# EAGLE design Pollin_NetIO_Clone (EAGLE 9.6.2)
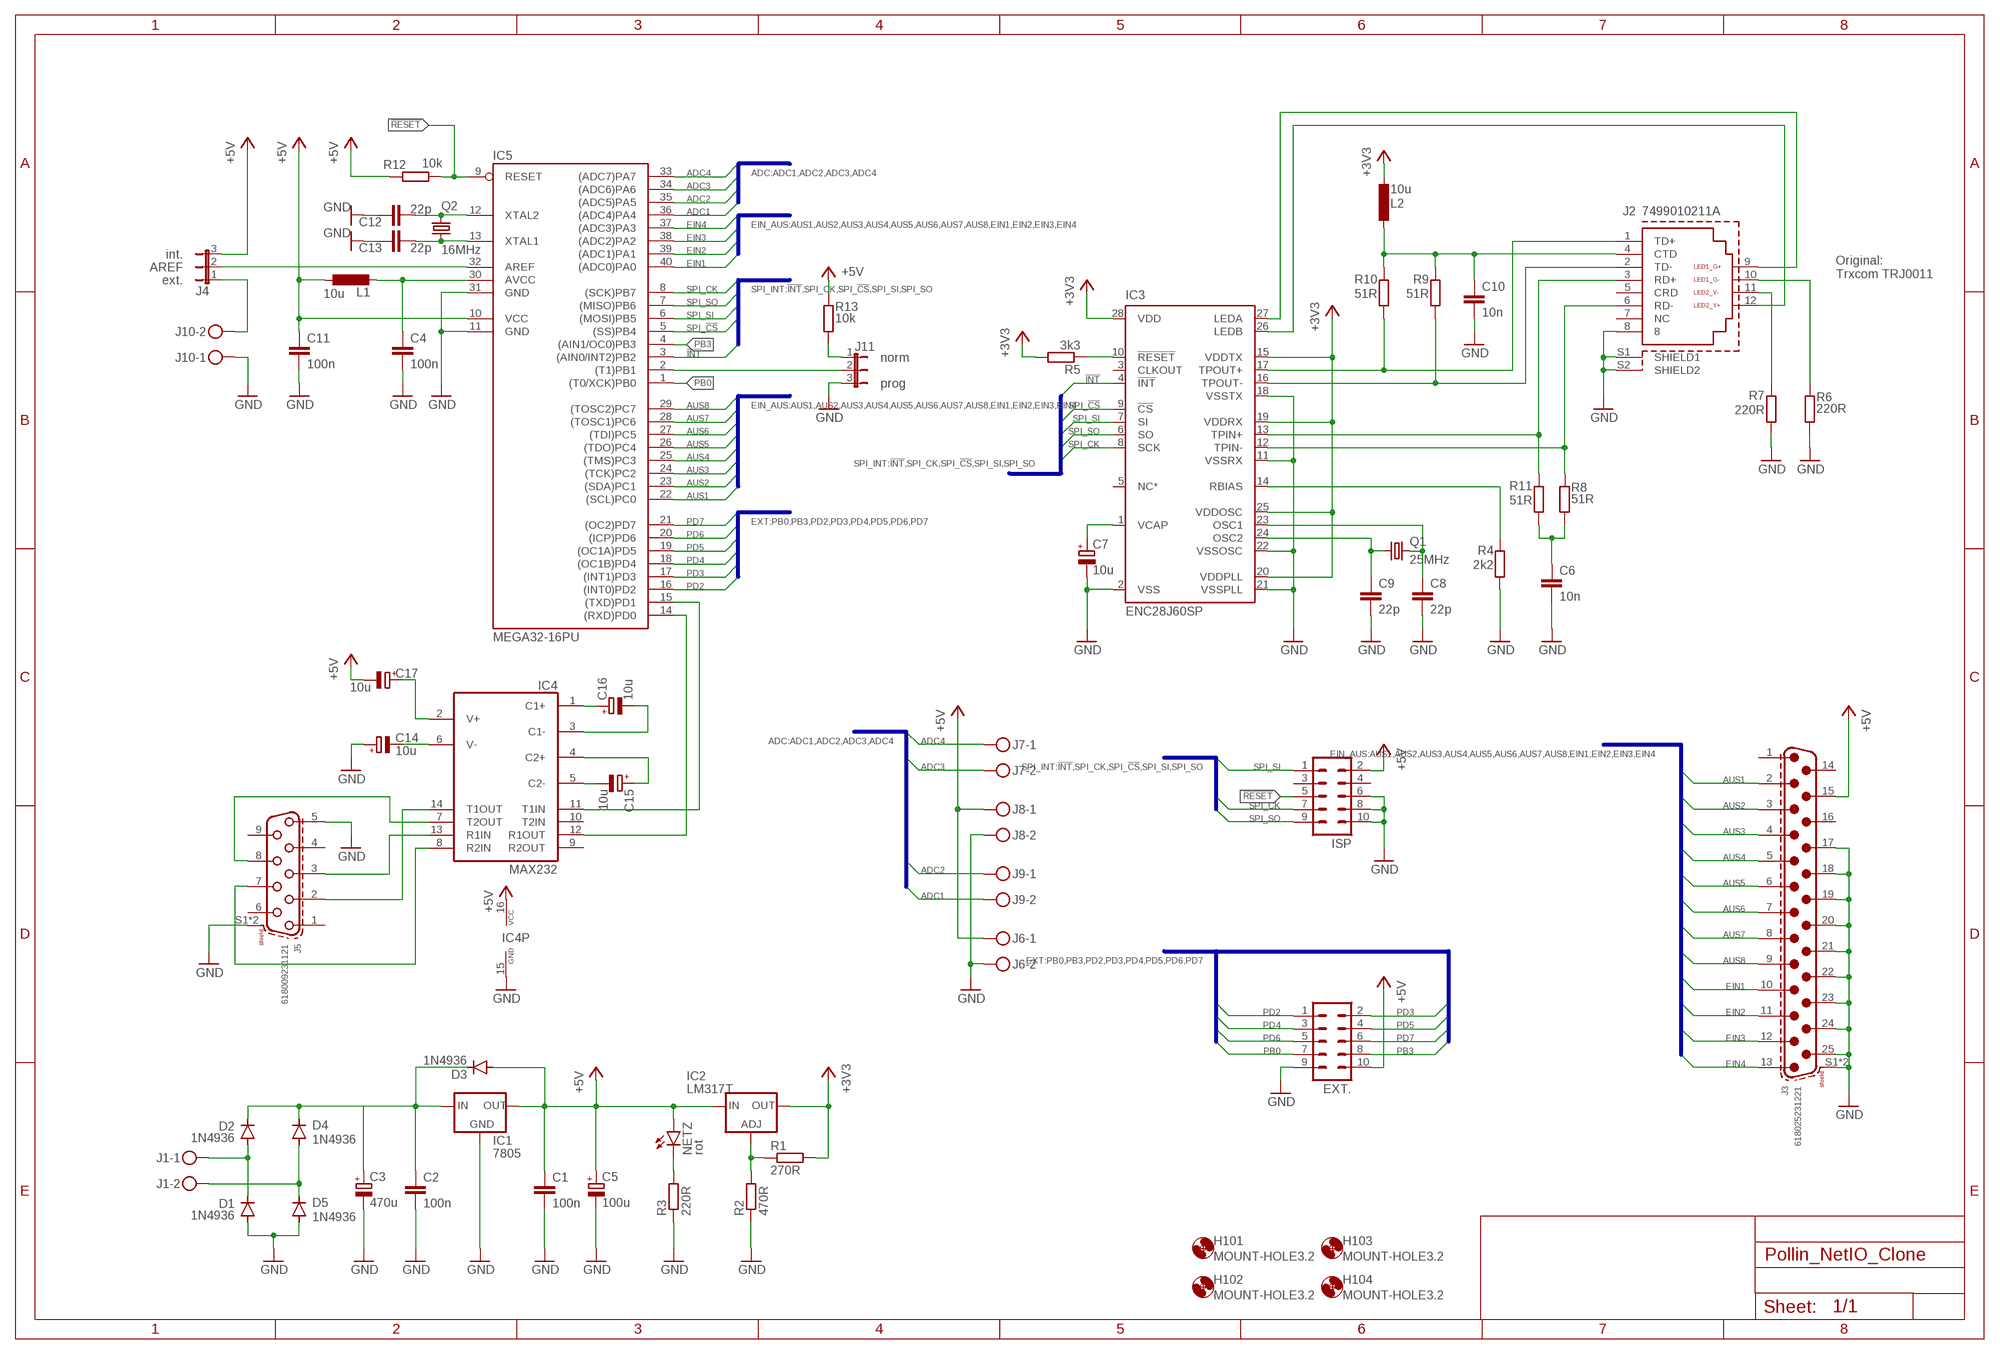
[diagram p0: schematic, sheet 1]

## Parts
C1  100n  C-EU050-025X075  [C050-025X075]
C2  100n  C-EU050-025X075  [C050-025X075]
C3  470u  CPOL-EUE5-10.5  [E5-10,5]
C4  100n  C-EU050-025X075  [C050-025X075]
C5  100u  CPOL-EUE5-5  [E5-5]
C6  10n  C-EU050-025X075  [C050-025X075]
C7  10u  CPOL-EUE5-5  [E5-5]
C8  22p  C-EU050-024X044  [C050-024X044]
C9  22p  C-EU050-024X044  [C050-024X044]
C10  10n  C-EU050-025X075  [C050-025X075]
C11  100n  C-EU050-025X075  [C050-025X075]
C12  22p  C-EU050-024X044  [C050-024X044]
C13  22p  C-EU050-024X044  [C050-024X044]
C14  10u  CPOL-EUE5-5  [E5-5]
C15  10u  CPOL-EUE5-5  [E5-5]
C16  10u  CPOL-EUE5-5  [E5-5]
C17  10u  CPOL-EUE5-5  [E5-5]
D1  1N4936  1N4933  [DO41-10]
D2  1N4936  1N4933  [DO41-10]
D3  1N4936  1N4933  [DO41-10]
D4  1N4936  1N4933  [DO41-10]
D5  1N4936  1N4933  [DO41-10]
EXT.  ML10  [ML10]
H101  MOUNT-HOLE3.2  [3,2]
H102  MOUNT-HOLE3.2  [3,2]
H103  MOUNT-HOLE3.2  [3,2]
H104  MOUNT-HOLE3.2  [3,2]
IC1  7805  78XXS  [78XXS]
IC2  LM317T  LM317TS  [317TS]
IC3  ENC28J60SP  [DIL28-3]
IC4  MAX232  [DIL16]
IC5  MEGA32-16PU  MEGA32-P  [DIL40]
ISP  ML10  [ML10]
J1  MKDSN1,5/2-5,08  [MKDSN1,5/2-5,08]
J2  7499010211A  WE-RJ45_7499010211A  [7499010211A]
J3  618025231221  6180XX231221_618025231221  [618025231221]
J4  JP2E  [JP2]
J5  618009231121  6180XX231121_618009231121  [618009231121]
J6  MKDSN1,5/2-5,08  [MKDSN1,5/2-5,08]
J7  MKDSN1,5/2-5,08  [MKDSN1,5/2-5,08]
J8  MKDSN1,5/2-5,08  [MKDSN1,5/2-5,08]
J9  MKDSN1,5/2-5,08  [MKDSN1,5/2-5,08]
J10  MKDSN1,5/2-5,08  [MKDSN1,5/2-5,08]
J11  JP2E  [JP2]
L1  10u  L-EU0207/15  [0207/15]
L2  10u  L-EU0207/15  [0207/15]
NETZ  rot  LED5MM  [LED5MM]
Q1  25MHz  CRYSTALHC49S  [HC49/S]
Q2  16MHz  CRYSTALHC49S  [HC49/S]
R1  270R  R-EU_0207/10  [0207/10]
R2  470R  R-EU_0207/10  [0207/10]
R3  220R  R-EU_0207/10  [0207/10]
R4  2k2  R-EU_0207/10  [0207/10]
R5  3k3  R-EU_0207/10  [0207/10]
R6  220R  R-EU_0207/10  [0207/10]
R7  220R  R-EU_0207/10  [0207/10]
R8  51R  R-EU_0207/10  [0207/10]
R9  51R  R-EU_0207/10  [0207/10]
R10  51R  R-EU_0207/10  [0207/10]
R11  51R  R-EU_0207/10  [0207/10]
R12  10k  R-EU_0207/10  [0207/10]
R13  10k  R-EU_0207/10  [0207/10]

## Nets
!INT: IC3.4(!INT) IC5.3((AIN0/INT2)PB2)
!RESET: IC5.9(RESET) ISP.5 R12.2
+3V3: IC2.2(OUT) IC3.15(VDDTX) IC3.19(VDDRX) IC3.20(VDDPLL) IC3.25(VDDOSC) IC3.28(VDD) L2.2 R1.2 R5.2
+5V: C1.1 C5.+ C11.1 C17.- D3.A EXT..10 IC1.OUT IC2.3(IN) IC4.16(VCC) IC5.10(VCC) ISP.2 J3.15 J4.3 J6.1 J8.1 L1.1 NETZ.A R12.1 R13.2
ADC1: IC5.36((ADC4)PA4) J9.2
ADC2: IC5.35((ADC5)PA5) J9.1
ADC3: IC5.34((ADC6)PA6) J7.2
ADC4: IC5.33((ADC7)PA7) J7.1
AREF: IC5.32(AREF) J4.2
AREF_EXT: J4.1 J10.2
AUS1: IC5.22((SCL)PC0) J3.2
AUS2: IC5.23((SDA)PC1) J3.3
AUS3: IC5.24((TCK)PC2) J3.4
AUS4: IC5.25((TMS)PC3) J3.5
AUS5: IC5.26((TDO)PC4) J3.6
AUS6: IC5.27((TDI)PC5) J3.7
AUS7: IC5.28((TOSC1)PC6) J3.8
AUS8: IC5.29((TOSC2)PC7) J3.9
AVCC: C4.1 IC5.30(AVCC) L1.2
EIN1: IC5.40((ADC0)PA0) J3.10
EIN2: IC5.39((ADC1)PA1) J3.11
EIN3: IC5.38((ADC2)PA2) J3.12
EIN4: IC5.37((ADC3)PA3) J3.13
GND: C1.2 C2.2 C3.- C4.2 C5.- C6.2 C7.- C8.2 C9.2 C10.2 C11.2 C12.1 C13.1 C14.+ D1.A D5.A EXT..9 IC1.GND IC3.2(VSS) IC3.11(VSSRX) IC3.18(VSSTX) IC3.21(VSSPLL) IC3.22(VSSOSC) IC4.15(GND) IC5.11(GND) IC5.31(GND) ISP.6 ISP.8 ISP.10 J2.8 J2.S1(SHIELD1) J2.S2(SHIELD2) J3.17 J3.18 J3.19 J3.20 J3.21 J3.22 J3.23 J3.24 J3.25 J3.S1(SHIELD) J3.S2(SHIELD) J5.5 J5.S1(SHIELD) J5.S2(SHIELD) J6.2 J8.2 J10.1 J11.3 R2.1 R3.1 R4.1 R6.1 R7.1
LEDA: IC3.27(LEDA) J2.9(LED1_G+)
LEDB: IC3.26(LEDB) J2.12(LED2_Y+)
N$1: C12.2 IC5.12(XTAL2) Q2.2
N$2: C13.2 IC5.13(XTAL1) Q2.1
N$4: IC5.2((T1)PB1) J11.2
N$6: C8.1 IC3.23(OSC1) Q1.1
N$7: C9.1 IC3.24(OSC2) Q1.2
N$9: D1.C D2.A J1.1
N$10: D4.A D5.C J1.2
N$11: C2.1 C3.+ D2.C D3.C D4.C IC1.IN
N$12: NETZ.K(C) R3.2
N$13: IC3.14(RBIAS) R4.2
N$14: IC2.1(ADJ) R1.1 R2.2
N$15: IC3.10(!RESET) R5.1
N$16: IC3.17(TPOUT+) J2.1(TD+) R10.1
N$17: IC3.16(TPOUT-) J2.2(TD-) R9.1
N$18: IC3.13(TPIN+) J2.3(RD+) R11.2
N$19: IC3.12(TPIN-) J2.6(RD-) R8.2
N$20: C10.1 J2.4(CTD) L2.1 R9.2 R10.2
N$21: C6.1 R8.1 R11.1
N$24: J11.1 R13.1
N$26: C7.+ IC3.1(VCAP)
N$27: C16.+ IC4.1(C1+)
N$28: C16.- IC4.3(C1-)
N$29: C15.+ IC4.4(C2+)
N$30: C15.- IC4.5(C2-)
N$31: C17.+ IC4.2(V+)
N$32: C14.- IC4.6(V-)
N$33: IC4.7(T2OUT) J5.8
N$34: IC4.8(R2IN) J5.7
N$35: IC4.14(T1OUT) J5.2
N$36: IC4.13(R1IN) J5.3
N$38: J2.11(LED2_Y-) R7.2
N$39: J2.10(LED1_G-) R6.2
PB0: EXT..7 IC5.1((T0/XCK)PB0)
PB3: EXT..8 IC5.4((AIN1/OC0)PB3)
PD2: EXT..1 IC5.16((INT0)PD2)
PD3: EXT..2 IC5.17((INT1)PD3)
PD4: EXT..3 IC5.18((OC1B)PD4)
PD5: EXT..4 IC5.19((OC1A)PD5)
PD6: EXT..5 IC5.20((ICP)PD6)
PD7: EXT..6 IC5.21((OC2)PD7)
RXD: IC4.12(R1OUT) IC5.14((RXD)PD0)
SPI_!CS: IC3.9(!CS) IC5.5((SS)PB4)
SPI_CK: IC3.8(SCK) IC5.8((SCK)PB7) ISP.7
SPI_SI: IC3.7(SI) IC5.6((MOSI)PB5) ISP.1
SPI_SO: IC3.6(SO) IC5.7((MISO)PB6) ISP.9
TXD: IC4.11(T1IN) IC5.15((TXD)PD1)
Unconnected: IC3.3(CLKOUT) IC3.5(NC*) IC4.9(R2OUT) IC4.10(T2IN) ISP.3 ISP.4 J2.5(CRD) J2.7(NC) J3.1 J3.14 J3.16 J5.1 J5.4 J5.6 J5.9

## Buses
SPI_INT:!INT,SPI_CK,SPI_!CS,SPI_SI,SPI_SO
EIN_AUS:AUS1,AUS2,AUS3,AUS4,AUS5,AUS6,AUS7,AUS8,EIN1,EIN2,EIN3,EIN4
ADC:ADC1,ADC2,ADC3,ADC4
EXT:PB0,PB3,PD2,PD3,PD4,PD5,PD6,PD7

## Notes on the sheet
- int.
- AREF
- Original:
  Trxcom TRJ0011
- ext.
- norm
- prog

## Library data of the parts
C1 C2 C4 C6 C8-C13 = rcl:C-EU: CAPACITOR, European symbol; SPICEPREFIX: C
C3 C5 C7 C14-C17 = rcl:CPOL-EU: POLARIZED CAPACITOR, European symbol; SPICEPREFIX: C
D1-D5 = diode:1N4933: DIODE fast recovery rectifier, 1A
EXT. ISP = con-ml:ML10: HARTING; OC_FARNELL: unknown; OC_NEWARK: unknown
H101-H104 = holes:MOUNT-HOLE: MOUNTING HOLE with drill center marker
IC1 = v-reg:78XXS: VOLTAGE REGULATOR
IC2 = v-reg:LM317TS: VOLTAGE REGULATOR
IC3 = microchip:ENC28J60: Stand-Alone Ethernet Controller with SPI Interface Source: http://ww1.microchip.com/downloads/en/DeviceDoc/39662c.pdf; MF: MICROCHIP; MPN: ENC28J60/SP; OC_FARNELL: 1084619; OC_NEWARK: 96K3661
IC4 = maxim:MAX232: RS232 TRANSCEIVER; MF: MAXIM; MPN: MAX232ACPE+; OC_FARNELL: 9723773; OC_NEWARK: 68K4544
IC5 = atmel:MEGA32-P: MICROCONTROLLER 32 Kbytes FLASH 2 Kbytes SRAM 1 Kbytes EEPROM USART 8-channel 10 bit ADC Source: www.atmel.com .. doc2503.pdf; MPN: ATMEGA32-16PU; OC_FARNELL: 1661729; OC_NEWARK: 51P1794
J1 J6-J10 = con-phoenix-508:MKDSN1,5/2-5,08: MKDSN 1,5/ 2-5,08 Printklemme Nennstrom: 13,5 A Nennspannung: 250 V Rastermaß: 5,08 mm Polzahl: 2 Anschlussart: Schraubanschluss Montage: Löten Anschlussrichtung Leiter/Platine: 0 ° Artikelnummer: 1729128 Source: http://eshop.phoenixcontact.com .. 1729128.pdf
J2 = Wurth_Signal & Communications_WE-RJ45_LAN:WE-RJ45_7499010211A: WE-RJ45 LAN Transformer Characteristics RJ45 Connector with integrated transformer / common mode choke Power over Ethernet up to 50 Watt and speeds up to 10 Gbit/s Available in SMD, THT and THT with USB Compliant with standards: IEEE 802.3u, IEEE 802.3ab, IEEE 802.3af, IEEE 802.3at, IEEE 802.3an and upcoming IEE 802.3bt Applications Suitable for industrial temperatures from –40 °C up to +85 °C Compatible to Industrial Ethernet systems like EtherCAT or Profinet Compliant with most IC’s for Ethernet applications such as Microchip, Texas Instruments, Broadcom, Linear Technology Hubs, Routers, Switches, IP cameras, IoT applications <https://www.we-online.com/components/media/o35731v209%20Family-WE-RJ45LAN-7499xxxxxx.jpg> Details see: www.we-online.com/components/products/WE-LAN-RJ45 <www.we-online.com/catalog/WE-LAN-RJ45/?utm_source=eagle_model&utm_medium=description_link&utm_campaign=eisos_eagle> Updated by Ella Wu 2023-08-16 2023 (C) Wurth Elektronik; DATA-RATE: 10/100 Base-T; DATASHEET-URL: https://www.we-online.com/redexpert/spec/7499010211A?ae; LED: green-yellow; MOUNT: THT; PART-NUMBER: 7499010211A; POE: non-PoE; PORTS: 1; USB: No
J3 = Wurth_Connectors_WR-DSUB:6180XX231221_618025231221: WR-DSUB 8.08 mm Male Angled PCB Connector w. Hex Screw Kind Properties Quality Class:3 as per IEC 60 603-13 Gender:Male Type:Angled Insulator Material:PBT Insulator Flammability Rating:UL94 V-0 Color:Black Contact Material:Copper Alloy Contact Plating:Gold Contact Type:Stamped Shielding Material:Steel Shielding Plating:Nickel General Information Operating Temperature:-55 up to +105 °C Compliance:RoHS Electrical Properties IR1:3 A Working Voltage:125 V (AC) Withstanding Voltage:100 V (AC) Contact Resistance:30 mΩ <https://www.we-online.com/catalog/media/o33083v209%20Family_WR-DSUB_6180xx231221.jpg> Details see: www.we-online.com/en/components/products/DSUB_MALE_ANGLED_PCB_CONNECTOR_W_HEX_SCREW_8_08MM_6180XX231221 Updated by Ella Wu 2023-03-21 2023 (C) Würth Elektronik; DATASHEET-URL: https://www.we-online.com/redexpert/spec/618025231221?ae; GENDER: Male; PART-NUMBER: 618025231221; PINS: 25; TYPE: Angled; WE-NUMBER: 618025231221; WORKING-VOLTAGE: 125 V(AC)
J4 J11 = jumper:JP2E: JUMPER
J5 = Wurth_Connectors_WR-DSUB:6180XX231121_618009231121: WR-DSUB 8.08 mm Female Angled PCB Connector w. Hex Screw Kind Properties Quality Class：3 as per IEC 60 603-13 Gender:Female Type:Angled Insulator Material:PBT Insulator Flammability Rating:UL94 V-0 Color:Black Contact Material:Copper Alloy Contact Plating:Gold Contact Type:Stamped Shielding Material:Steel Shielding Plating:Nickel General Information Operating Temperature:-55 up to +105 °C Compliance：RoHS Electrical Properties IR 1：3 A Working Voltage:125 V (AC) Withstanding Voltage:1000 V (AC) Contact Resistance:30 mΩ <https://www.we-online.com/catalog/media/o33082v209%20Family_WR-DSUB_6180xx231121.jpg> Details see: https://www.we-online.com/catalog/en/DSUB_FEMALE_ANGLED_PCB_CONNECTOR_W_HEX_SCREW_8_08MM_6180XX231121/ Updated by Yingchun, Shan 2020-01-13 2020 (C) Würth Elektronik; DATASHEET-URL: https://www.we-online.com/redexpert/spec/618009231121?ae; GENDER: Female; PART-NUMBER: 618009231121; PINS: 9; TYPE: Angled; WE-NUMBER: 618009231121; WORKING-VOLTAGE: 125 V(AC)
L1 L2 = rcl:L-EU: INDUCTOR, European symbol; SPICEPREFIX: L
NETZ = led:LED: LED OSRAM: - CHIPLED LG R971, LG N971, LY N971, LG Q971, LY Q971, LO R971, LY R971 LH N974, LH R974 LS Q976, LO Q976, LY Q976 LO Q996 - Hyper CHIPLED LW Q18S LB Q993, LB Q99A, LB R99A - SideLED LS A670, LO A670, LY A670, LG A670, LP A670 LB A673, LV A673, LT A673, LW A673 LH A674 LY A675 LS A676, LA A676, LO A676, LY A676, LW A676 LS A679, LY A679, LG A679 - Hyper Micro SIDELED® LS Y876, LA Y876, LO Y876, LY Y876 LT Y87S - SmartLED LW L88C, LW L88S LB L89C, LB L89S, LG L890 LS L89K, LO L89K, LY L89K LS L896, LA L896, LO L896, LY L896 - TOPLED LS T670, LO T670, LY T670, LG T670, LP T670 LSG T670, LSP T670, LSY T670, LOP T670, LYG T670 LG T671, LOG T671, LSG T671 LB T673, LV T673, LT T673, LW T673 LH T674 LS T676, LA T676, LO T676, LY T676, LB T676, LH T676, LSB T676, LW T676 LB T67C, LV T67C, LT T67C, LS T67K, LO T67K, LY T67K, LW E67C LS E67B, LA E67B, LO E67B, LY E67B, LB E67C, LV E67C, LT E67C LW T67C LS T679, LY T679, LG T679 LS T770, LO T770, LY T770, LG T770, LP T770 LB T773, LV T773, LT T773, LW T773 LH T774 LS E675, LA E675, LY E675, LS T675 LS T776, LA T776, LO T776, LY T776, LB T776 LHGB T686 LT T68C, LB T68C - Hyper Mini TOPLED® LB M676 - Mini TOPLED Santana® LG M470 LS M47K, LO M47K, LY M47K Source: http://www.osram.convergy.de LUXEON: - LUMILED® LXK2-PW12-R00, LXK2-PW12-S00, LXK2-PW14-U00, LXK2-PW14-V00 LXK2-PM12-R00, LXK2-PM12-S00, LXK2-PM14-U00 LXK2-PE12-Q00, LXK2-PE12-R00, LXK2-PE12-S00, LXK2-PE14-T00, LXK2-PE14-U00 LXK2-PB12-K00, LXK2-PB12-L00, LXK2-PB12-M00, LXK2-PB14-N00, LXK2-PB14-P00, LXK2-PB14-Q00 LXK2-PR12-L00, LXK2-PR12-M00, LXK2-PR14-Q00, LXK2-PR14-R00 LXK2-PD12-Q00, LXK2-PD12-R00, LXK2-PD12-S00 LXK2-PH12-R00, LXK2-PH12-S00 LXK2-PL12-P00, LXK2-PL12-Q00, LXK2-PL12-R00 Source: www.luxeon.com KINGBRIGHT: KA-3528ASYC Source: www.kingbright.com
Q1 Q2 = crystal:CRYSTAL: CRYSTAL; OC_FARNELL: 1667008; OC_NEWARK: unknown
R1-R13 = rcl:R-EU_: RESISTOR, European symbol; SPICEPREFIX: R

## Board
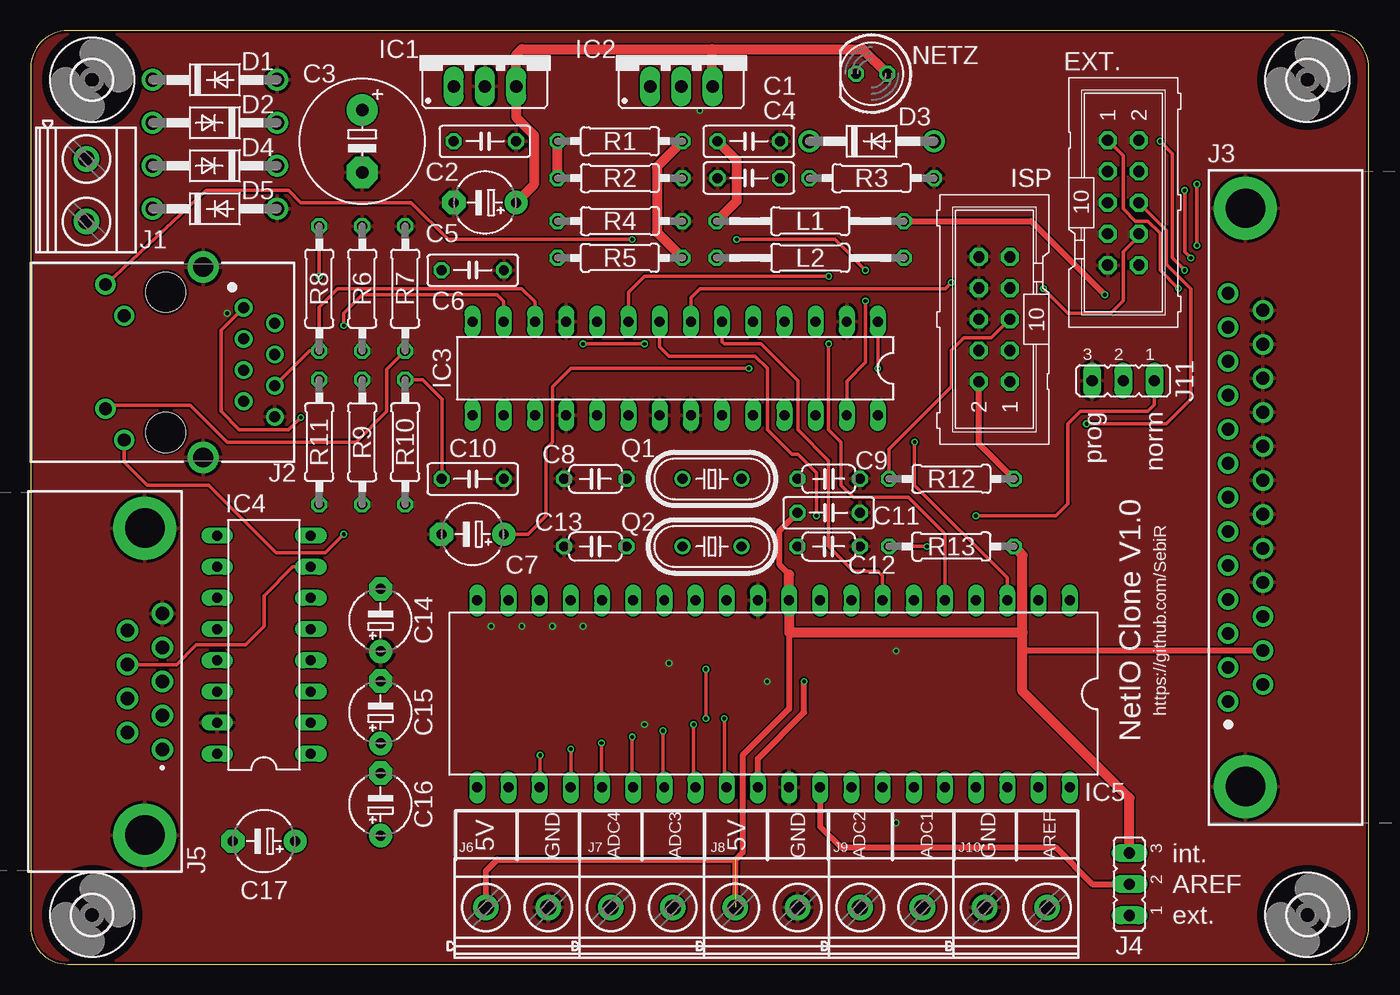
[diagram p1: board, top side]
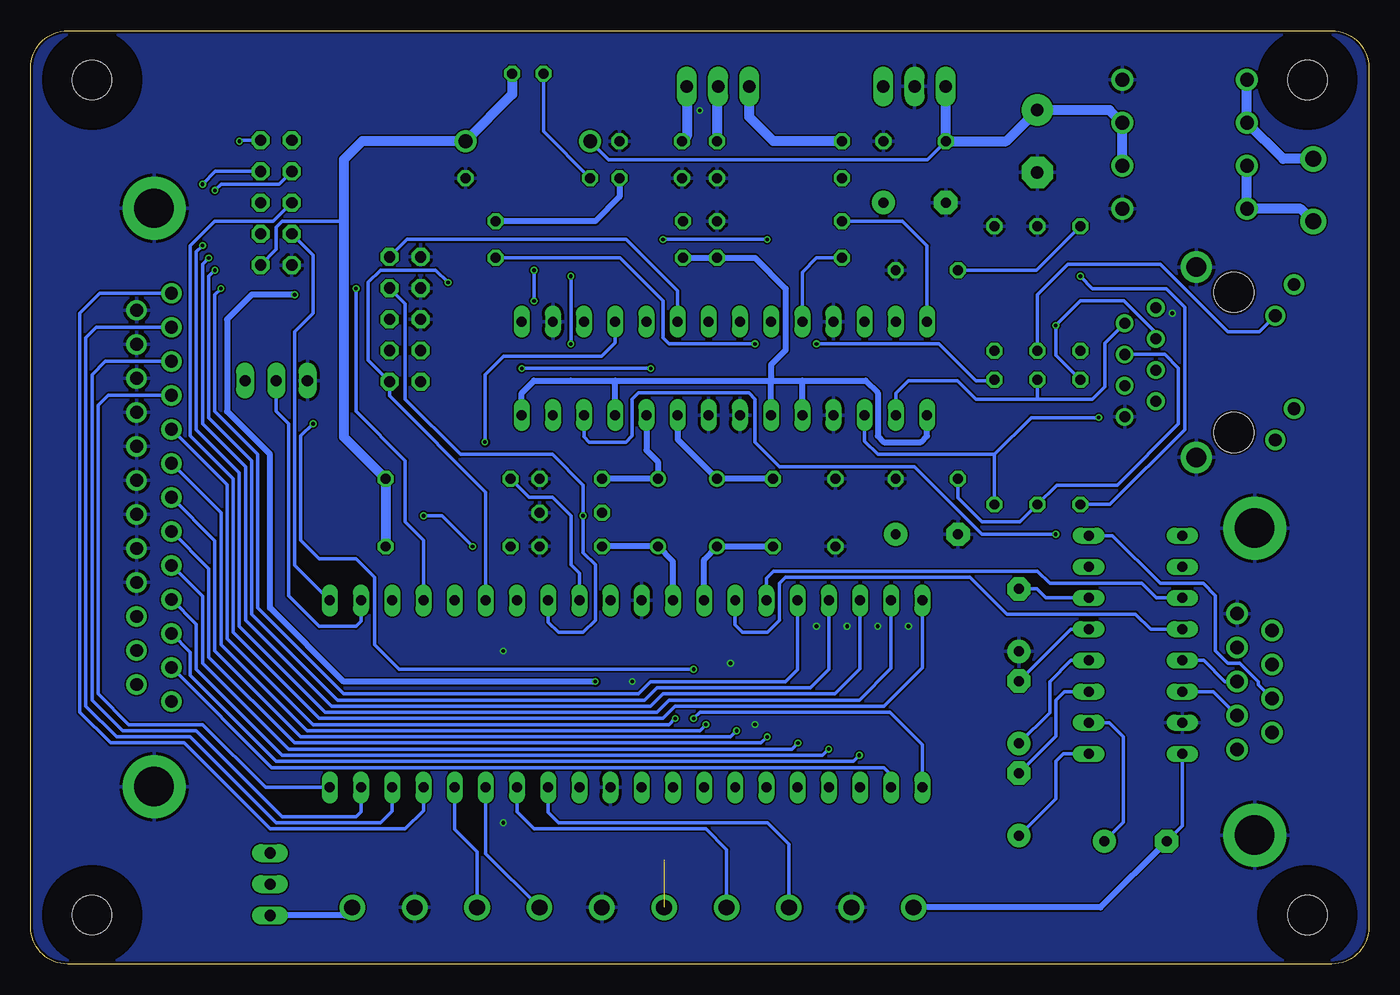
[diagram p2: board, bottom side, seen from below]

Size 109 x 76 mm. Coordinates in mm from the lower left corner, seen from the top.
Outline: 0,73 0,3 arc90 3,0 106,0 arc90 109,3 109,73 arc90 106,76 3,76 arc90 0,73
Copper layers (1*16): Top 0.035mm / dielectric 1.6mm / Bottom 0.035mm
Design rules "jlcpcb-2layers": minimum track width 0.2mm, minimum drill 0.3mm, track to track 5mil, track to pad 5mil, pad to pad 5mil, via to via 5mil, smd to smd 5mil, copper to edge 0.2mm, drill to drill 6mil, minimum pad ring 0.125mm, minimum via ring 0.125mm, stop-mask expansion 4mil, vias tented up to drill 0.5mm, thermal gap 10mil

### Footprints (pad centres in the part's own frame; a part is rotated, then mirrored left to right if it is on the bottom)
C050-025X075 = drill 0.813 octagon: 1 -2.54,0; 2 2.54,0
E5-10,5 = drill 1.016 pad 2.54: + -2.54,0 | drill 1.016 pad 2.54 octagon: - 2.54,0
E5-5 = drill 0.813 pad 1.905: + -2.54,0 | drill 0.813 pad 1.905 octagon: - 2.54,0
C050-024X044 = drill 0.813 octagon: 1 -2.54,0; 2 2.54,0
DO41-10 = drill 1.118: A 5.08,0; C -5.08,0
ML10 = drill 0.914 octagon: 1 -5.08,-1.27; 2 -5.08,1.27; 3 -2.54,-1.27; 4 -2.54,1.27; 5 0,-1.27; 6 0,1.27; 7 2.54,-1.27; 8 2.54,1.27; 9 5.08,-1.27; 10 5.08,1.27
3,2 = hole 3.2: 0,0
78XXS = drill 1.016 long: GND 0,-2.54; IN -2.54,-2.54; OUT 2.54,-2.54
317TS = drill 1.016 long: 1 -2.54,-2.54; 2 0,-2.54; 3 2.54,-2.54
DIL28-3 = drill 0.813 long: 1 -16.51,-3.81; 2 -13.97,-3.81; 3 -11.43,-3.81; 4 -8.89,-3.81; 5 -6.35,-3.81; 6 -3.81,-3.81; 7 -1.27,-3.81; 8 1.27,-3.81; 9 3.81,-3.81; 10 6.35,-3.81; 11 8.89,-3.81; 12 11.43,-3.81; 13 13.97,-3.81; 14 16.51,-3.81; 15 16.51,3.81; 16 13.97,3.81; 17 11.43,3.81; 18 8.89,3.81; 19 6.35,3.81; 20 3.81,3.81; 21 1.27,3.81; 22 -1.27,3.81; 23 -3.81,3.81; 24 -6.35,3.81; 25 -8.89,3.81; 26 -11.43,3.81; 27 -13.97,3.81; 28 -16.51,3.81
DIL16 = drill 0.813 long: 1 -8.89,-3.81; 2 -6.35,-3.81; 3 -3.81,-3.81; 4 -1.27,-3.81; 5 1.27,-3.81; 6 3.81,-3.81; 7 6.35,-3.81; 8 8.89,-3.81; 9 8.89,3.81; 10 6.35,3.81; 11 3.81,3.81; 12 1.27,3.81; 13 -1.27,3.81; 14 -3.81,3.81; 15 -6.35,3.81; 16 -8.89,3.81
DIL40 = drill 0.813 long: 1 -24.13,-7.62; 2 -21.59,-7.62; 3 -19.05,-7.62; 4 -16.51,-7.62; 5 -13.97,-7.62; 6 -11.43,-7.62; 7 -8.89,-7.62; 8 -6.35,-7.62; 9 -3.81,-7.62; 10 -1.27,-7.62; 11 1.27,-7.62; 12 3.81,-7.62; 13 6.35,-7.62; 14 8.89,-7.62; 15 11.43,-7.62; 16 13.97,-7.62; 17 16.51,-7.62; 18 19.05,-7.62; 19 21.59,-7.62; 20 24.13,-7.62; 21 24.13,7.62; 22 21.59,7.62; 23 19.05,7.62; 24 16.51,7.62; 25 13.97,7.62; 26 11.43,7.62; 27 8.89,7.62; 28 6.35,7.62; 29 3.81,7.62; 30 1.27,7.62; 31 -1.27,7.62; 32 -3.81,7.62; 33 -6.35,7.62; 34 -8.89,7.62; 35 -11.43,7.62; 36 -13.97,7.62; 37 -16.51,7.62; 38 -19.05,7.62; 39 -21.59,7.62; 40 -24.13,7.62
MKDSN1,5/2-5,08 = drill 1.3 pad 2: 1 -2.561,0.025; 2 2.519,0.025
7499010211A = drill 0.9: 1 -4.445,6.35; 2 -3.175,8.89; 3 -1.905,6.35; 4 -0.635,8.89; 5 0.635,6.35; 6 1.905,8.89; 7 3.175,6.35; 8 4.445,8.89 | drill 1.03: 9 -6.325,-4.9; 10 -3.785,-3.38; 11 3.785,-4.9; 12 6.325,-3.38 | drill 1.6: S1 -7.745,3.05; S2 7.745,3.05 | hole 3.25: -5.715,0; 5.715,0
618025231221 = drill 1.04: 1 -16.62,7.72; 2 -13.85,7.72; 3 -11.08,7.72; 4 -8.31,7.72; 5 -5.54,7.72; 6 -2.77,7.72; 7 0,7.72; 8 2.77,7.72; 9 5.54,7.72; 10 8.31,7.72; 11 11.08,7.72; 12 13.85,7.72; 13 16.62,7.72; 14 -15.235,4.88; 15 -12.465,4.88; 16 -9.695,4.88; 17 -6.925,4.88; 18 -4.155,4.88; 19 -1.385,4.88; 20 1.385,4.88; 21 4.155,4.88; 22 6.925,4.88; 23 9.695,4.88; 24 12.465,4.88; 25 15.235,4.88 | drill 3.2: S1 -23.55,6.3; S2 23.55,6.3
JP2 = drill 0.914 long: 1 -2.54,0; 2 0,0; 3 2.54,0
618009231121 = drill 1.09: 1 5.54,7.72; 2 2.77,7.72; 3 0,7.72; 4 -2.77,7.72; 5 -5.54,7.72; 6 4.155,4.88; 7 1.385,4.88; 8 -1.385,4.88; 9 -4.155,4.88 | drill 3.2: S1 -12.5,6.3; S2 12.5,6.3
0207/15 = drill 0.813 octagon: 1 -7.62,0; 2 7.62,0
LED5MM = drill 0.813 octagon: A -1.27,0; K 1.27,0
HC49/S = drill 0.813: 1 -2.413,0; 2 2.413,0
0207/10 = drill 0.813 octagon: 1 -5.08,0; 2 5.08,0

### Placement (x,y rotation side)
C1  58.5,67 0 top
C2  37,67 0 top
C3  27,67 270 top
C4  58.5,64 180 top
C5  37,62 180 top
C6  36,56.5 0 top
C7  36,35 180 top
C8  46,39.5 180 top
C9  65,39.5 0 top
C10  36,39.5 0 top
C11  65,36.75 0 top
C12  65,34 180 top
C13  46,34 0 top
C14  28.5,28 90 top
C15  28.5,20.5 90 top
C16  28.5,13 90 top
C17  19,10 180 top
D1  15,72 0 top
D2  15,68.5 180 top
D3  68.5,67 0 top
D4  15,65 180 top
D5  15,61.5 0 top
EXT.  89,62 270 top
H101  5,4 0 top
H102  104,4 0 top
H103  5,72 0 top
H104  104,72 0 top
IC1  37,74 0 top
IC2  53,74 0 top
IC3  52.5,48.5 180 top
IC4  19,26 90 top
IC5  60.5,22 180 top
ISP  78.5,52.5 90 top
J1  4.5,63 270 top
J2  11,49 270 top
J3  105.25,38 90 top
J4  89.5,6.5 90 top
J5  3,23 270 top
J6  39.64,4.58 0 top
J7  49.8,4.58 0 top
J8  59.96,4.58 0 top
J9  70.12,4.58 0 top
J10  80.28,4.58 0 top
J11  89,47.5 180 top
L1  63.5,60.5 0 top
L2  63.5,57.5 180 top
NETZ  68.5,72.5 180 top
Q1  55.5,39.5 0 top
Q2  55.5,34 0 top
R1  48,67 0 top
R2  48,64 180 top
R3  68.5,64 180 top
R4  48,60.5 180 top
R5  48,57.5 0 top
R6  27,55 270 top
R7  30.5,55 270 top
R8  23.5,55 270 top
R9  27,42.5 270 top
R10  30.5,42.5 90 top
R11  23.5,42.5 90 top
R12  75,39.5 180 top
R13  75,34 0 top

### Tracks (layer width: path | path; a pad name or v marks a point on that pad's centre or on a via)
!INT  (via drill 0.3)
  Top 0.3: IC5.3 79.55,31.45 72,39 v72,42.5
  Bottom 0.3: IC3.4 61.39,50.61 62.5,49.5 70.5,49.5 72,48 v72,42.5
!RESET
  Top 0.3: R12.2 69.92,41.92 75,47 75,50 76,51 78.27,51 ISP.5
  Bottom 0.3: R12.2 68.42,38 66.5,38 65,36.5 65,32.5 64.31,31.81 IC5.9
+3V3
  Top 0.8: R1.2 51,64.92 51,59.58 R5.2
  Bottom 0.5: IC3.28 69.01,46.49 68,47.5 65,47.5 61.39,47.5 | IC3.15 35.99,43.01 36.5,42.5 39.5,42.5 40,43 40,46.5 41,47.5 46.15,47.5 | 61.39,47.5 48.69,47.5 | 48.69,47.5 46.15,47.5 | IC3.20 48.69,47.5 | IC3.19 46.15,47.5 | IC3.25 61.39,47.5 | 48.69,47.5 48.69,48.81 47.5,50 47.5,55 50,57.5 R5.2 L2.2
  Bottom 0.8: IC2.2 53.08,71.38 R1.2
+5V  (1 unrouted)
  Top 0.3: J3.15 100.33,25.5
  Top 0.5: J8.1 57.4,8.5 58,9.1 58,17 61.77,20.77 61.77,27 | J6.1 37.08,7.58 38,8.5 57.4,8.5 | 100.33,25.5 80.8,25.5 | R12.1 77.23,42.35 ISP.2 | 61.77,31.73 61,32.5 61,35.29 C11.1
  Top 0.8: C5.+ 41,63.46 41,67.5 39.54,68.96 IC1.OUT 39.54,74.04 40,74.5 55.5,74.5 | 55.5,74.5 67.77,74.5 NETZ.A | IC2.3 55.5,71.5 55.5,74.5 | C1.1 57.5,65.46 57.5,62.12 L1.1 | J4.3 89.5,13.5 80.8,22.2 80.8,25.5 80.8,27 | R13.2 80.8,33.28 80.8,27 | 61.77,31.73 IC5.10 61.77,27 80.8,27
  Bottom 0.3: IC4.16 15.19,11.27 C17.- | EXT..10 89,58.19 89,60 88.5,60.5 83.5,60.5
  Bottom 0.5: C17.- 21.86,4.61 J6.1
  Bottom 0.8: IC2.3 55.54,67.42 C1.1 | NETZ.A 69.77,70.81 D3.A 82,67 83.5,65.5 83.5,60.5 83.5,42.92 R12.1 R13.2
ADC1
  Bottom 0.3: IC5.36 74.47,10.97 72.64,9.14 J9.2
ADC2
  Bottom 0.3: IC5.35 71.93,8.98 J9.1
ADC3
  Bottom 0.3: IC5.34 69.39,12.39 68,11 54,11 52.32,9.32 J7.2
ADC4
  Bottom 0.3: IC5.33 66.85,12.35 66,11.5 49,11.5 47.24,9.74 J7.1
AREF
  Top 0.5: IC5.32 64.31,11.19 66,9.5 83.5,9.5 86.5,6.5 J4.2
AREF_EXT
  Bottom 0.5: J10.2 83.44,3.96 J4.1
AUS1
  Bottom 0.3: IC5.22 38.91,15.41 39.5,16 89.38,16 J3.2
AUS2  (via drill 0.3)
  Top 0.3: IC5.23 41.5,14.43 v41.5,17
  Bottom 0.3: v41.5,17 42,16.5 89,16.5 96,23.5 96,25.39 J3.3
AUS3  (via drill 0.3)
  Top 0.3: IC5.24 v44,17.5
  Bottom 0.3: v44,17.5 44.5,17 88.5,17 95.5,24 95.5,27.66 J3.4
AUS4  (via drill 0.3)
  Top 0.3: IC5.25 46.5,14.41 v46.5,18
  Bottom 0.3: v46.5,18 47,17.5 88,17.5 95,24.5 95,29.93 J3.5
AUS5  (via drill 0.3)
  Top 0.3: IC5.26 49,14.45 v49,18.5
  Bottom 0.3: v49,18.5 49.5,18 87.5,18 94.5,25 94.5,32.2 J3.6
AUS6  (via drill 0.3)
  Top 0.3: IC5.27 51.5,14.49 v51.5,19
  Bottom 0.3: v51.5,19 52,18.5 87,18.5 94,25.5 94,34.47 J3.7
AUS7  (via drill 0.3)
  Top 0.3: IC5.28 54,14.53 v54,19.5
  Bottom 0.3: v54,19.5 54.5,19 86.5,19 93.5,26 93.5,36.74 J3.8
AUS8  (via drill 0.3)
  Top 0.3: IC5.29 56.5,14.57 v56.5,20
  Bottom 0.3: v56.5,20 57,19.5 86,19.5 93,26.5 93,39.01 J3.9
AVCC  (via drill 0.3)
  Top 0.5: IC5.30 59.23,16.73 63,20.5 v63,23 | L1.2 81.5,60.5 v87.5,54.5
  Bottom 0.5: C4.1 61.04,62.46 63,60.5 L1.2 | v63,23 83.5,23 89.5,29 89.5,41.5 93,45 93,52.5 91,54.5 v87.5,54.5
EIN1
  Bottom 0.3: J3.10 102.69,46.31 103.5,45.5 103.5,22 101,19.5 95,19.5 89.88,14.38 IC5.40
EIN2
  Bottom 0.3: J3.11 102.92,49.08 104,48 104,21.5 101.5,19 95.5,19 88.5,12 82.5,12 82.09,12.41 IC5.39
EIN3
  Bottom 0.3: J3.12 103.65,51.85 104.5,51 104.5,21 102,18.5 96,18.5 89,11.5 80.5,11.5 79.55,12.45 IC5.38
EIN4
  Bottom 0.3: J3.13 103.38,54.62 105,53 105,20.5 102.5,18 96.5,18 89.5,11 78.5,11 77,12.5 IC5.37
GND  (via drill 0.3)
  other vias: 54.5,69.5 37.5,27.5 40,27.5 42.5,27.5 45,27.5 50,19.5 60,23 70.5,11.5 70.5,25.5 52,24.5 16,53
  pour Top: 106,0 3,0 arc-90 0,3 0,73 arc-90 3,76 106,76 arc-90 109,73 109,3 arc-90
  pour Bottom: 106,0 3,0 arc-90 0,3 0,73 arc-90 3,76 106,76 arc-90 109,73 109,3 arc-90
LEDA  (via drill 0.3)
  Top 0.3: J2.9 14.3,63 21,63 22,62 31,62 34,59 v49,59 | v57.5,59 65.5,59 v68,56.5 | v68,54 68,49 66.47,47.47 IC3.27
  Bottom 0.3: v49,59 v57.5,59 | v68,56.5 v68,54
LEDB  (via drill 0.3)
  Top 0.3: v25.5,35 24,33.5 20,33.5 14.5,39 9.5,39 7.62,40.88 J2.12
  Bottom 0.3: IC3.26 63.93,42.93 63.5,42.5 60.5,42.5 60,43 60,46 59.5,46.5 50.5,46.5 50,46 50,42.5 48,40.5 37,40.5 31.5,35 v25.5,35
N$1
  Bottom 0.5: IC5.12 56.69,32.78 Q2.2 C12.2
N$2
  Bottom 0.5: IC5.13 54.15,32.94 Q2.1 C13.2
N$4
  Bottom 0.3: IC5.2 82.09,27.91 82.5,27.5 85.5,27.5 88,30 88,44 89,45 J11.2
N$6
  Bottom 0.5: IC3.23 56.31,42.72 Q1.1 C8.1
N$7
  Bottom 0.5: IC3.24 58.85,41.85 57.91,40.91 Q1.2 C9.1
N$9
  Bottom 0.8: J1.1 6.98,65.56 D2.A D1.C
N$10
  Bottom 0.8: J1.2 5.54,61.5 D5.C D4.A
N$11
  Bottom 0.3: C2.1 35.96,65.5 61.92,65.5 D3.C
  Bottom 0.8: D4.C D2.C 21.12,69.54 C3.+ 29.54,67 C2.1 IC1.IN
N$12
  Bottom 0.3: NETZ.K 67.23,67.81 R3.2
N$13
  Bottom 0.3: R4.2 38,60.5 35.99,58.49 IC3.14
N$14
  Top 0.8: R2.2 R1.1
  Bottom 0.8: R1.1 48.5,67 50.46,68.96 IC2.1
N$15
  Bottom 0.3: IC3.10 46.15,56.35 45,57.5 R5.1
N$16  (via drill 0.3)
  Top 0.3: v22,44.5 21,43.5 17,43.5 15.5,45 15.5,51.59 J2.1
  Bottom 0.3: IC3.17 41.07,42.57 40,41.5 30.5,41.5 | R10.1 30.5,41.5 | v22,44.5 27.5,44.5 30.5,41.5
N$17
  Bottom 0.3: IC3.16 38.53,46.47 37.5,47.5 33.5,47.5 32,46 27,46 | 27,46 22.5,46 21.5,47 21.5,50.56 J2.2 | R9.1 27,46
N$18  (via drill 0.3)
  Top 0.3: IC3.13 38.53,53.97 38,54.5 27,54.5 25.5,53 v25.5,52
  Bottom 0.3: J2.3 17.35,51.41 19.95,54 23.5,54 v25.5,52 25.5,49.58 R11.2
N$19
  Top 0.3: IC3.12 41.07,53.93 40,55 25,55 23.5,53.5 R8.2 22.71,49.92 J2.6
N$20  (via drill 0.3)
  Top 0.3: R10.2 31.92,47.58 33.5,46 33.5,39.54 C10.1 | v50,50.5 v45,50.5
  Bottom 0.3: C10.1 33.46,37.96 31.5,36 28.42,36 R9.2 25.42,39 20.5,39 15.5,44 15.5,48.5 16.64,49.63 J2.4 | L2.1 61,57.5 57.5,54 57.5,51 57,50.5 v50,50.5 | v45,50.5 35,50.5 32,47.5 30.58,47.5 R10.2
N$21  (via drill 0.3)
  Top 0.3: v23.5,56 R8.1
  Bottom 0.3: R11.1 21.08,37.42 15,43.5 15,53.5 16.5,55 22.5,55 v23.5,56 | C6.1 27.08,56.5 R8.1
N$24  (via drill 0.3)
  Top 0.3: R13.1 v73,34 | v77,36.5 83.5,36.5 84.5,37.5 84.5,44 85.5,45 91,45 91.54,45.54 J11.1
  Bottom 0.3: v73,34 75.5,36.5 v77,36.5
N$26  (via drill 0.3)
  Top 0.3: C7.+ 40.5,35 42,36.5 42,42 42.5,42.5 42.5,47 44,48.5 v58.5,48.5 | v69,48.5 IC3.1
  Bottom 0.3: v58.5,48.5 v69,48.5
N$27
  Bottom 0.3: IC4.1 24.89,17.11 25.5,16.5 25.5,13.46 C16.+
N$28
  Bottom 0.3: IC4.3 24.81,22.19 25.5,21.5 25.5,18.54 C16.-
N$29
  Bottom 0.3: IC4.4 24.27,24.73 26,23 26,20.46 C15.+
N$30
  Bottom 0.3: IC4.5 24.27,27.27 C15.-
N$31
  Bottom 0.3: IC4.2 21.15,19.65 20,18.5 20,11.54 C17.+
N$32
  Bottom 0.3: IC4.6 26.31,29.81 27.04,30.54 C14.-
N$33
  Top 0.3: IC4.7 21.35,32.35 19,30 19,27.5 17.5,26 13.5,26 11.88,24.39 J5.8
N$34
  Bottom 0.3: IC4.8 20.89,34.89 17,31 13.5,31 12.5,30 12.5,25.5 11.5,24.5 10.5,24.5 9,23 9,22.73 J5.7
N$35
  Bottom 0.3: IC4.14 12.68,22.19 J5.2
N$36
  Bottom 0.3: IC4.13 13.45,24.73 11.72,23 J5.3
N$38
  Top 0.3: R7.2 29,48.42 29,45 26.5,42.5 16,42.5 13,45.5 6.38,45.5 J2.11
N$39
  Bottom 0.3: R6.2 27,54.5 24.5,57 17,57 11.5,51.5 8.9,51.5 J2.10
PB0
  Bottom 0.3: IC5.1 87.5,32.49 87.5,51.5 86,53 86,57.73 EXT..7
PB3  (via drill 0.3)
  Top 0.3: EXT..8 90.27,59.27 89,58 89,54 88,53 84.5,53 v82.5,55
  Bottom 0.3: IC5.4 77,34.5 78.5,36 78.5,41 82.5,45 v82.5,55
PD2  (via drill 0.3)
  Top 0.3: v93.5,55 92,56.5 92,59.5 91,60.5 90,60.5 89,61.5 89,65.81 EXT..1
  Bottom 0.3: IC5.16 46.53,23.97 47.5,23 58.5,23 59.5,22 83.5,22 90.5,29 90.5,41.5 94,45 94,54.5 v93.5,55
PD3  (via drill 0.3)
  Top 0.3: v94,56.5 93,57.5 93,66 v92,67
  Bottom 0.3: IC5.17 43.99,24.01 45.5,22.5 58,22.5 59,21.5 84,21.5 91,28.5 91,41 94.5,44.5 94.5,56 v94,56.5 | EXT..2 91.92,67.08 v92,67
PD4  (via drill 0.3)
  Top 0.3: v94.5,57.5 94,58 v94,63
  Bottom 0.3: IC5.18 41.45,24.05 43.5,22 57.5,22 58.5,21 84.5,21 91.5,28 91.5,40.5 95,44 95,57 v94.5,57.5 | EXT..3 88.77,63.5 93.5,63.5 v94,63
PD5  (via drill 0.3)
  Top 0.3: v95,58.5 v95,63.5
  Bottom 0.3: IC5.19 38.91,24.09 41.5,21.5 57,21.5 58,20.5 85,20.5 92,27.5 92,40 95.5,43.5 95.5,58 v95,58.5 | EXT..4 93.96,64.54 v95,63.5
PD6
  Bottom 0.3: IC5.20 36.37,24.13 39.5,21 56.5,21 57.5,20 85.5,20 92.5,27 92.5,39.5 96,43 96,58.5 94,60.5 89.23,60.5 EXT..5
PD7  (via drill 0.3)
  Top 0.3: v55,20 v55,24 | v86,44 92.5,44 94.5,46 94.5,55 92.5,57 92.5,59.77 EXT..6
  Bottom 0.3: IC5.21 36.37,17.87 39,20.5 54.5,20.5 v55,20 | v55,24 79,24 81,26 81,31.5 82.5,33 85.5,33 87,34.5 87,43 v86,44
RXD
  Bottom 0.3: IC5.14 51.61,27.61 51,27 49,27 48,28 48,31 47.5,31.5 32.5,31.5 29.5,28.5 19,28.5 17.77,27.27 IC4.12
SPI_!CS  (via drill 0.3)
  Top 0.3: IC5.5 74.47,35.03 71.5,38 67,38 66,39 66,42.5 65,43.5 v65,50.5 | IC3.9 48.69,54.69 50,56 v65,56
  Bottom 0.3: v65,50.5 v65,56
SPI_CK  (via drill 0.3)
  Top 0.3: IC3.8 51.23,50.27 52,49.5 59,49.5 60,48.5 60,43.5 62,41.5 62.5,41.5 64,40 v64,36.5
  Bottom 0.3: IC5.8 66.85,27.85 66,27 64,27 63,28 63,32.5 64,33.5 v64,36.5 64,39 66.5,41.5 74,41.5 78.5,46 78.5,53.77 ISP.7
SPI_SI  (via drill 0.3)
  Top 0.3: IC3.7 53.77,54.27 54.5,55 74.5,55 v75,55.5
  Bottom 0.3: IC5.6 71.93,38.43 79.77,46.27 ISP.1 81.5,49.15 81.5,55.5 80.5,56.5 76,56.5 v75,55.5
SPI_SO
  Top 0.3: IC5.7 69.39,31.61 69,32 67,32 65,34 65,41 62.5,43.5 62.5,47.5 59.5,50.5 56.5,50.5 56.31,50.69 IC3.6
  Bottom 0.3: ISP.9 78.35,59 60.5,59 56.31,54.81 IC3.6
TXD
  Bottom 0.3: IC5.15 49.07,31.43 48.5,32 27,32 26,31 18.5,31 17.31,29.81 IC4.11

### Text on the board
tPlace: prog | norm | NetIO Clone V1.0 | https://github.com/SebiR | 5V | GND | ADC4 | ADC3 | 5V | GND | ADC2 | ADC1 | GND | AREF | int. | AREF | ext.